# Altium schematic sheet 05_Optical_Heads.SchDoc: External optical heads and cable wiring
size A4; Author: Henrique Rosa; DrawnBy: Henq / Codex; Engineer: Henrique Rosa; Address1: rua; Address: Bairro; Address3: São Paulo, SP - Brasil; Address4: 55 (11) 9 6825-6715; DocumentNumber: GBS-OPT-04; Revision: A; SheetNumber: 05; SheetTotal: 06; Site: henq.com; VersionControl_RevNumber: 03; PageSetup: Record=PageOptions|CenterHorizontal=True|CenterVertical=True|PrintScale=0.98|XCorrection=1.00|YCorrection=1.00|PrintKind=0|BorderSize=5000000|LeftOffset=0|BottomOffset=0|Orientation=2|PaperLength=1000|PaperWidth=1000|Scale=100|PaperSource=7|PrintQuality=-3|MediaType=1|DitherType=10|PrintScaleMode=1|PaperKind=A4|PaperIndex=9
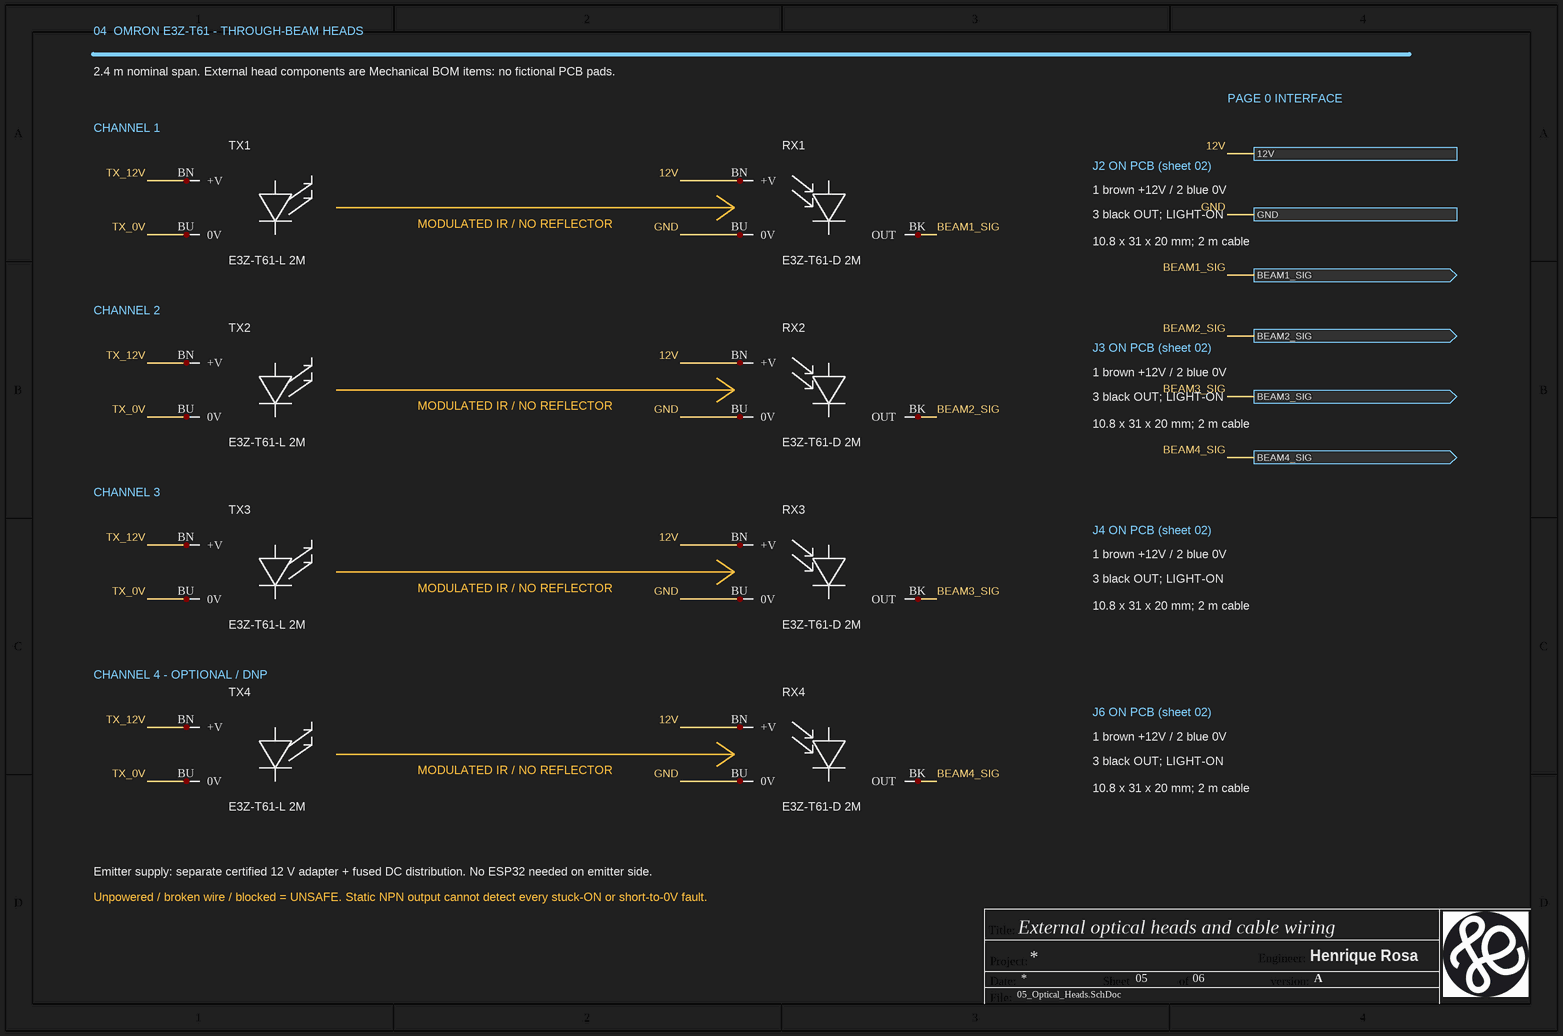
[diagram p0: 05_Optical_Heads.SchDoc]

## Parts
RX1  E3Z-T61-D 2M  (graphical)
RX2  E3Z-T61-D 2M  (graphical)
RX3  E3Z-T61-D 2M  (graphical)
RX4  E3Z-T61-D 2M  (graphical)
TX1  E3Z-T61-L 2M  (graphical)
TX2  E3Z-T61-L 2M  (graphical)
TX3  E3Z-T61-L 2M  (graphical)
TX4  E3Z-T61-L 2M  (graphical)

## Ports
12V, BEAM1_SIG (out), BEAM2_SIG (out), BEAM3_SIG (out), BEAM4_SIG (out), GND

## Nets
12V: RX1.BN(+V) RX2.BN(+V) RX3.BN(+V) RX4.BN(+V) ; port 12V
BEAM1_SIG: RX1.BK(OUT) ; port BEAM1_SIG
BEAM2_SIG: RX2.BK(OUT) ; port BEAM2_SIG
BEAM3_SIG: RX3.BK(OUT) ; port BEAM3_SIG
BEAM4_SIG: RX4.BK(OUT) ; port BEAM4_SIG
GND: RX1.BU(0V) RX2.BU(0V) RX3.BU(0V) RX4.BU(0V) ; port GND
TX_0V: TX1.BU(0V) TX2.BU(0V) TX3.BU(0V) TX4.BU(0V)
TX_12V: TX1.BN(+V) TX2.BN(+V) TX3.BN(+V) TX4.BN(+V)

## Notes on the sheet
- 04  OMRON E3Z-T61 - THROUGH-BEAM HEADS
- 2.4 m nominal span. External head components are Mechanical BOM items: no fictional PCB pads.
- PAGE 0 INTERFACE
- CHANNEL 1
- J2 ON PCB (sheet 02)
- MODULATED IR / NO REFLECTOR
- 1 brown +12V / 2 blue 0V
- 3 black OUT; LIGHT-ON
- 10.8 x 31 x 20 mm; 2 m cable
- CHANNEL 2
- J3 ON PCB (sheet 02)
- CHANNEL 3
- J4 ON PCB (sheet 02)
- CHANNEL 4 - OPTIONAL / DNP
- J6 ON PCB (sheet 02)
- Emitter supply: separate certified 12 V adapter + fused DC distribution. No ESP32 needed on emitter side.
- Unpowered / broken wire / blocked = UNSAFE. Static NPN output cannot detect every stuck-ON or short-to-0V fault.
- Title:
- Project:
- Date:
- Sheet
- of
- Engineer:
- version:
- File:
- Title
- Size:
- A4
- Number:
- Time:
- Revision:

## Library data of the parts
RX1-RX3 = *: RECEIVER / NPN LIGHT-ON; purchased in E3Z-T61 2M pair; frame-mounted, not PCB-mounted; Manufacturer: Omron; Populate: Yes; Intended footprint: NONE - external wired device; CAD status: External equipment symbol: no controller-PCB pads; mechanical CAD remains unverified.; Cable: Integral 2 m cable; BN brown +V / BU blue 0V / receiver BK black OUT; Supply: 12-24 VDC nominal; use regulated 12 V; BOM note: Buy one E3Z-T61 2M pair per TX/RX pair, not two pairs; Symbol representation: Complete powered photoelectric head; optical glyph is functional, not a bare discrete diode; Symbol provenance: Project-authored native Altium library; based on identified manufacturer part and pinout, not vendor-issued CAD; Assembly location: External installation; not mounted on controller PCB; Procurement list: docs/PIN_REPAIR.html - external hardware; Component refresh: 2026-09-10 sourced-symbol pass; not manufacturing release; Symbol adaptation: Keep existing part-specific symbol; package and procurement metadata retained. External equipment: deliberately no PCB footprint. Manufacturer mechanical CAD remains separate/unverified.; Manufacturer Part Number: E3Z-T61-D 2M; Package: EXTERNAL CABLED HEAD; Order as pair: E3Z-T61 2M; Body dimensions mm: 10.8 W x 31 H x 20 D; Mounting: Two M3 holes at 25.4 mm centres; optical face toward opposite upright; Datasheet: https://industrial.omron.eu/en/products/E3Z-T61-2M; 3D download: https://download.ia.omron.com/download/zip/ST/OEE/E3Z_T61/; Part Number: E3Z-T61-D 2M; Value: E3Z-T61-D 2M; Valor: E3Z-T61-D 2M
RX4 = *: RECEIVER / NPN LIGHT-ON; purchased in E3Z-T61 2M pair; frame-mounted, not PCB-mounted; Manufacturer: Omron; Populate: Optional channel 4; Intended footprint: NONE - external wired device; CAD status: External equipment symbol: no controller-PCB pads; mechanical CAD remains unverified.; Cable: Integral 2 m cable; BN brown +V / BU blue 0V / receiver BK black OUT; Supply: 12-24 VDC nominal; use regulated 12 V; BOM note: Buy one E3Z-T61 2M pair per TX/RX pair, not two pairs; Symbol representation: Complete powered photoelectric head; optical glyph is functional, not a bare discrete diode; Symbol provenance: Project-authored native Altium library; based on identified manufacturer part and pinout, not vendor-issued CAD; Assembly location: External installation; not mounted on controller PCB; Procurement list: docs/PIN_REPAIR.html - external hardware; Component refresh: 2026-09-10 sourced-symbol pass; not manufacturing release; Symbol adaptation: Keep existing part-specific symbol; package and procurement metadata retained. External equipment: deliberately no PCB footprint. Manufacturer mechanical CAD remains separate/unverified.; Manufacturer Part Number: E3Z-T61-D 2M; Package: EXTERNAL CABLED HEAD; Order as pair: E3Z-T61 2M; Body dimensions mm: 10.8 W x 31 H x 20 D; Mounting: Two M3 holes at 25.4 mm centres; optical face toward opposite upright; Datasheet: https://industrial.omron.eu/en/products/E3Z-T61-2M; 3D download: https://download.ia.omron.com/download/zip/ST/OEE/E3Z_T61/; Part Number: E3Z-T61-D 2M; Value: E3Z-T61-D 2M; Valor: E3Z-T61-D 2M
TX1-TX3 = *: EMITTER; purchased in E3Z-T61 2M pair; frame-mounted, not PCB-mounted; Manufacturer: Omron; Populate: Yes; Intended footprint: NONE - external wired device; CAD status: External equipment symbol: no controller-PCB pads; mechanical CAD remains unverified.; Cable: Integral 2 m cable; BN brown +V / BU blue 0V / receiver BK black OUT; Supply: 12-24 VDC nominal; use regulated 12 V; BOM note: Buy one E3Z-T61 2M pair per TX/RX pair, not two pairs; Symbol representation: Complete powered photoelectric head; optical glyph is functional, not a bare discrete diode; Symbol provenance: Project-authored native Altium library; based on identified manufacturer part and pinout, not vendor-issued CAD; Assembly location: External installation; not mounted on controller PCB; Procurement list: docs/PIN_REPAIR.html - external hardware; Component refresh: 2026-09-10 sourced-symbol pass; not manufacturing release; Symbol adaptation: Keep existing part-specific symbol; package and procurement metadata retained. External equipment: deliberately no PCB footprint. Manufacturer mechanical CAD remains separate/unverified.; Manufacturer Part Number: E3Z-T61-L 2M; Package: EXTERNAL CABLED HEAD; Order as pair: E3Z-T61 2M; Body dimensions mm: 10.8 W x 31 H x 20 D; Mounting: Two M3 holes at 25.4 mm centres; optical face toward opposite upright; Datasheet: https://industrial.omron.eu/en/products/E3Z-T61-2M; 3D download: https://download.ia.omron.com/download/zip/ST/OEE/E3Z_T61/; Part Number: E3Z-T61-L 2M; Value: E3Z-T61-L 2M
TX4 = *: EMITTER; purchased in E3Z-T61 2M pair; frame-mounted, not PCB-mounted; Manufacturer: Omron; Populate: Optional channel 4; Intended footprint: NONE - external wired device; CAD status: External equipment symbol: no controller-PCB pads; mechanical CAD remains unverified.; Cable: Integral 2 m cable; BN brown +V / BU blue 0V / receiver BK black OUT; Supply: 12-24 VDC nominal; use regulated 12 V; BOM note: Buy one E3Z-T61 2M pair per TX/RX pair, not two pairs; Symbol representation: Complete powered photoelectric head; optical glyph is functional, not a bare discrete diode; Symbol provenance: Project-authored native Altium library; based on identified manufacturer part and pinout, not vendor-issued CAD; Assembly location: External installation; not mounted on controller PCB; Procurement list: docs/PIN_REPAIR.html - external hardware; Component refresh: 2026-09-10 sourced-symbol pass; not manufacturing release; Symbol adaptation: Keep existing part-specific symbol; package and procurement metadata retained. External equipment: deliberately no PCB footprint. Manufacturer mechanical CAD remains separate/unverified.; Manufacturer Part Number: E3Z-T61-L 2M; Package: EXTERNAL CABLED HEAD; Order as pair: E3Z-T61 2M; Body dimensions mm: 10.8 W x 31 H x 20 D; Mounting: Two M3 holes at 25.4 mm centres; optical face toward opposite upright; Datasheet: https://industrial.omron.eu/en/products/E3Z-T61-2M; 3D download: https://download.ia.omron.com/download/zip/ST/OEE/E3Z_T61/; Part Number: E3Z-T61-L 2M; Value: E3Z-T61-L 2M